# Altium schematic sheet Superbot_motor_boost.SchDoc
size A4
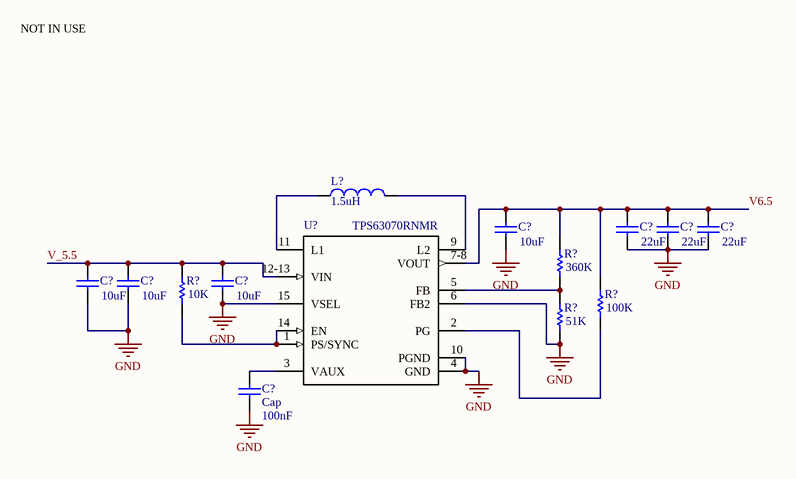
[diagram p0: Superbot_motor_boost.SchDoc]

## Parts
(Parts that share a designator on the sheet are numbered #1, #2 ... from top to bottom, then left to right.)
C?#1  value 10uF  [RAD-0.3]  (hidden comment: Cap)
C?#2  value 22uF  [RAD-0.3]  (hidden comment: Cap)
C?#3  value 22uF  [RAD-0.3]  (hidden comment: Cap)
C?#4  value 22uF  [RAD-0.3]  (hidden comment: Cap)
C?#5  value 10uF  [RAD-0.3]  (hidden comment: Cap)
C?#6  value 10uF  [RAD-0.3]  (hidden comment: Cap)
C?#7  value 10uF  [1608[0603]]  (hidden comment: Cap Semi)
C?#8  Cap  value 100nF  [RAD-0.3]
L?  value 1.5uH  [0402-A]  (hidden comment: Inductor)
R?#1  value 360K  [AXIAL-0.3]  (hidden comment: Res1)
R?#2  value 10K  [AXIAL-0.3]  (hidden comment: Res1)
R?#3  value 100K  [AXIAL-0.3]  (hidden comment: Res1)
R?#4  value 51K  [AXIAL-0.3]  (hidden comment: Res1)
U?  TPS63070RNMR  [QFN50P250X300X100-15N_TPS63070RNMR(Primary)]

## Nets
GND: C?#1.1 C?#2.1 C?#3.1 C?#4.1 C?#5.1 C?#6.1 C?#7.1 C?#8.1 R?#4.1 U?.4(GND) U?.6(FB2) U?.10(PGND) U?.15(VSEL)
V6.5: C?#1.2 C?#2.2 C?#3.2 C?#4.2 R?#1.2 R?#3.2 U?.7-8(VOUT)
V_5.5: C?#5.2 C?#6.2 C?#7.2 R?#2.2 U?.12-13(VIN)
NetC?#8_2: C?#8.2 U?.3(VAUX)
NetL?_1: L?.1 U?.11(L1)
NetL?_2: L?.2 U?.9(L2)
NetR?#1_1: R?#1.1 R?#4.2 U?.5(FB)
NetR?#2_1: R?#2.1 U?.1(PS/SYNC) U?.14(EN)
NetR?#3_1: R?#3.1 U?.2(PG)

## Notes on the sheet
- NOT IN USE

## Library data of the parts
C?#1-C?#6 C?#8 = Cap: Capacitor; Published: 8-Jun-2000; LatestRevisionDate: 17-Jul-2002; LatestRevisionNote: Re-released for DXP Platform.; PackageReference: RAD-0.3; Publisher: Altium Limited; PackageDescription: Radial Cap, Thru-Hole; 2 Leads; 0.3 in Pin Spacing
C?#7 = Cap Semi: Capacitor (Semiconductor SIM Model); Published: 8-Jun-2000; LatestRevisionDate: 29-May-2009; LatestRevisionNote: IPC-7351 Footprint Added.; PackageReference: C1206; Publisher: Altium Limited; PackageDescription: Chip Capacitor
L? = Inductor: Code_IEC: 1005; Published: 8-Jun-2000; LatestRevisionDate: 29-May-2009; LatestRevisionNote: IPC-7351 Footprint Added.; PackageReference: 0402-A; Publisher: Altium Limited; PackageDescription: Chip Inductor; Code_JEITA: 0402
R?#1-R?#4 = Res1: Resistor; Published: 8-Jun-2000; LatestRevisionDate: 17-Jul-2002; LatestRevisionNote: Re-released for DXP Platform.; PackageReference: AXIAL-0.3; Publisher: Altium Limited; PackageDescription: Axial Device, Thru-Hole; 2 Leads; 0.3 in Pin Spacing
U? = TPS63070RNMR: IC REG BCK BST ADJ 2A 15VQFN; MF: Texas Instruments; Digi-Key_Part_Number: 296-44874-1-ND; Digi-Key_Purchase_URL: https://www.digikey.com.au/product-detail/en/texas-instruments/TPS63070RNMR/296-44874-1-ND/6217416?WT.z_cid=ref_snapeda&utm_source=snapeda&utm_medium=aggregator&utm_campaign=buynow; MP: TPS63070RNMR; Package: VQFN-15 Texas Instruments; Value: *